# Altium schematic sheet PWR.SchDoc
size A3; SheetNumber: 5; SheetTotal: 8
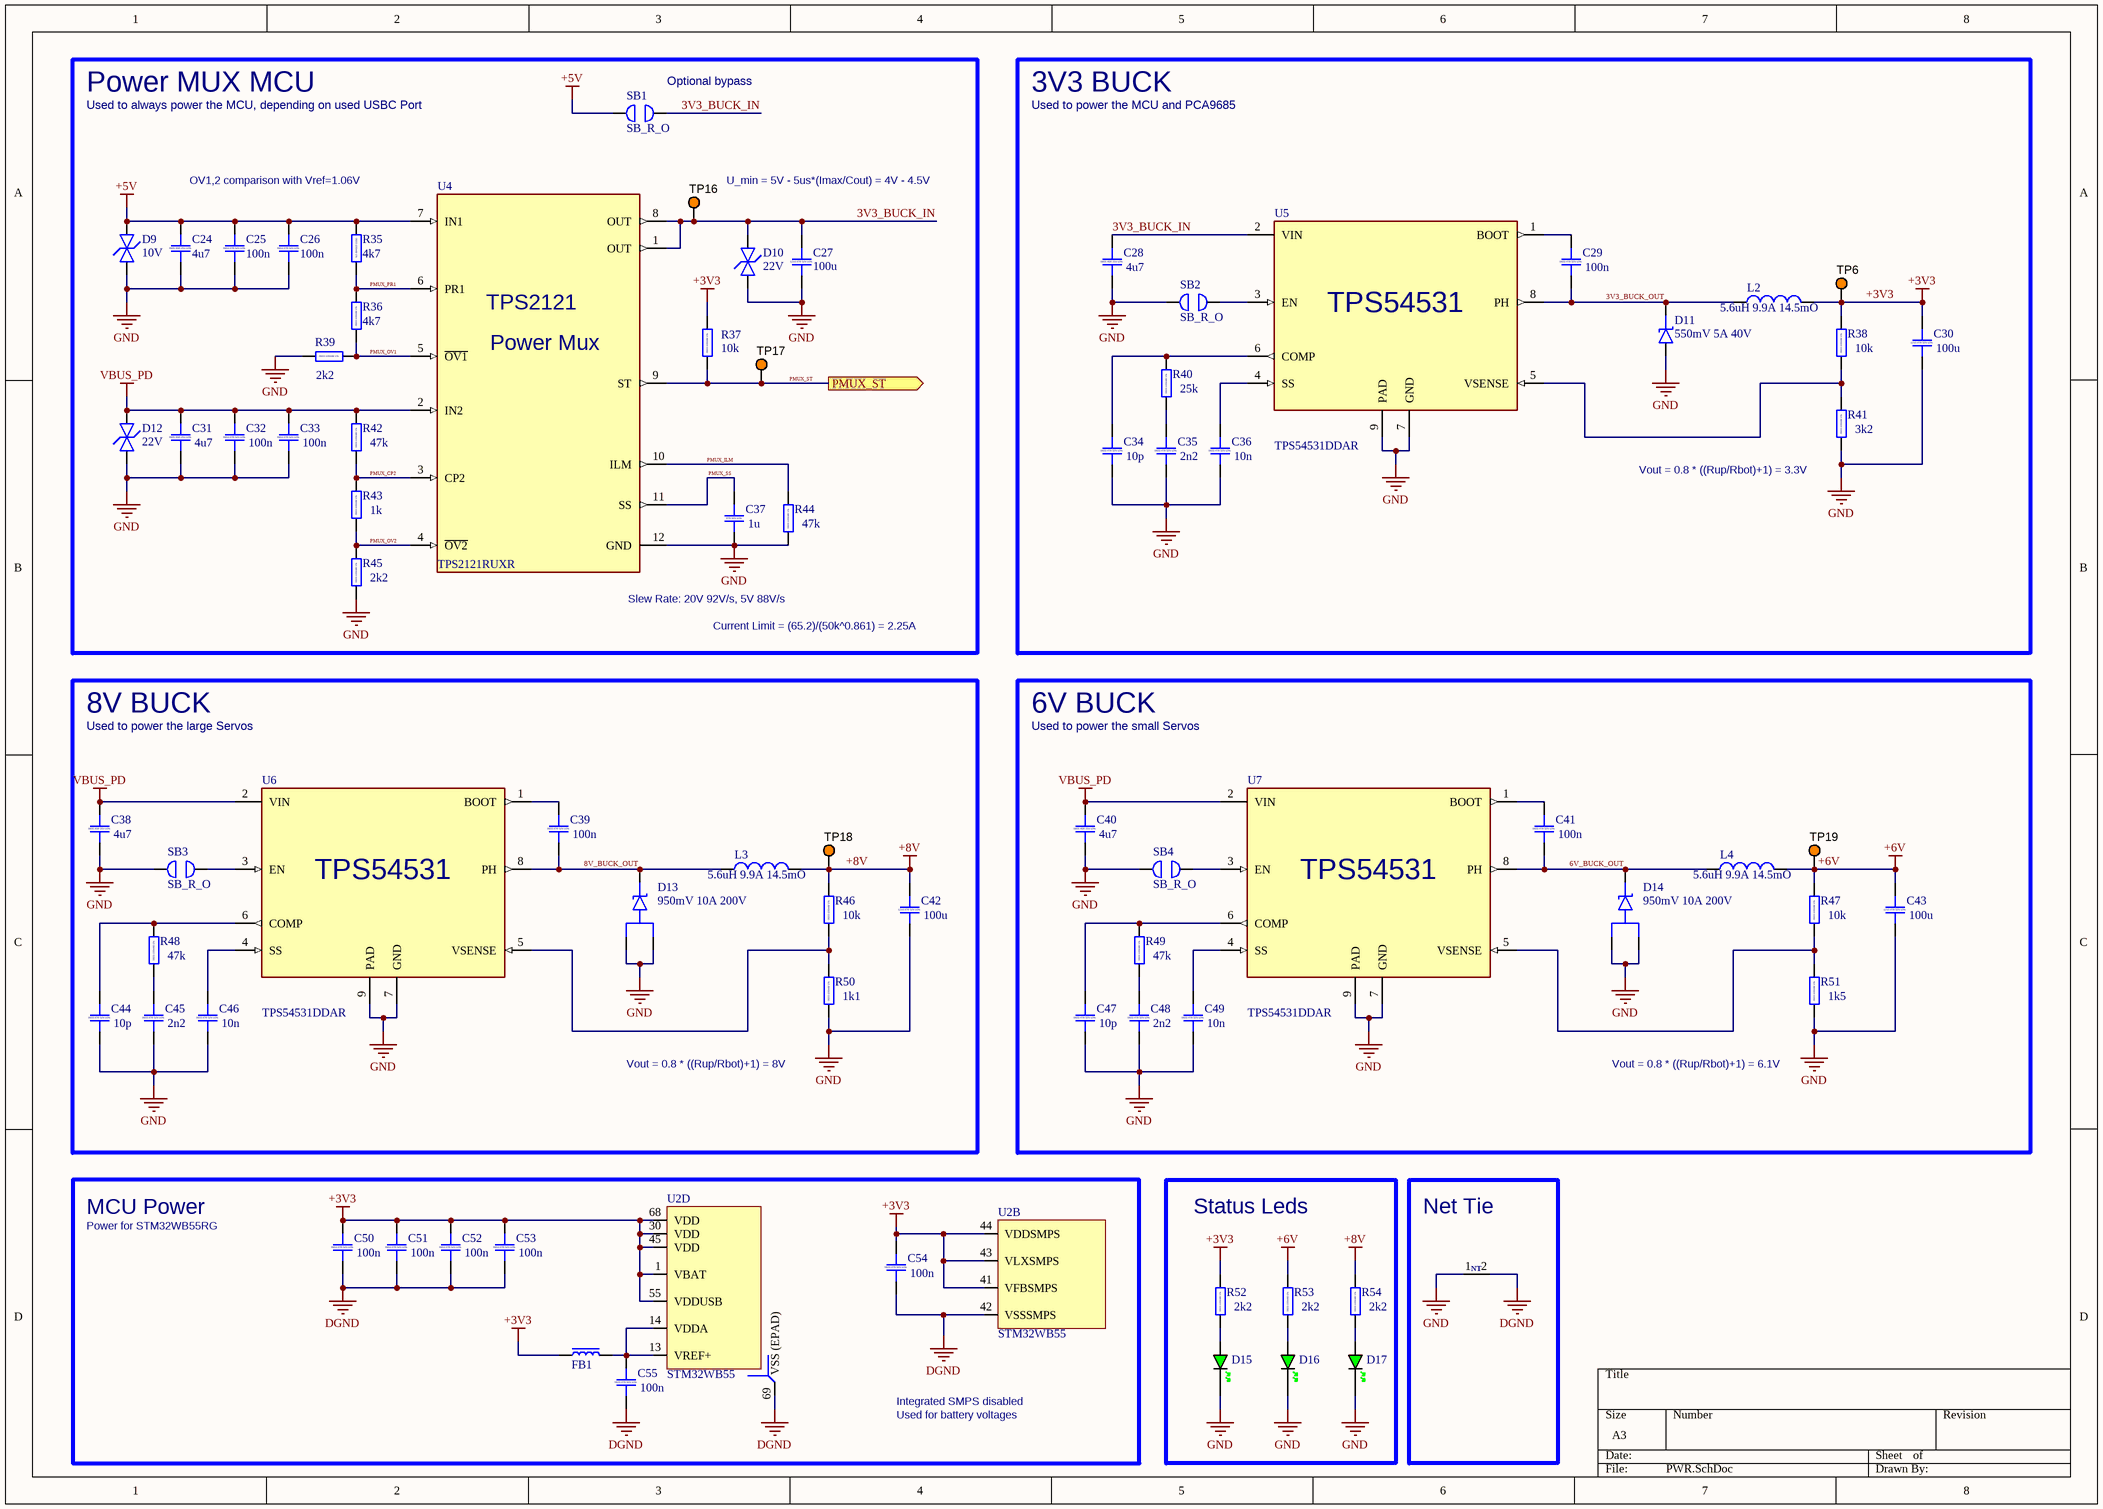
[diagram p0: PWR.SchDoc]

## Parts
C24  4u7  [CAP_0805]
C25  100n  [CAP_0603]
C26  100n  [CAP_0603]
C27  100u  [CAP_1210]
C28  4u7  [CAP_0805]
C29  100n  [CAP_0603]
C30  100u  [CAP_1210]
C31  4u7  [CAP_0805]
C32  100n  [CAP_0603]
C33  100n  [CAP_0603]
C34  10p  [CAP_0603]
C35  2n2  [CAP_0603]
C36  10n  [CAP_0603]
C37  1u  [CAP_0603]
C38  4u7  [CAP_0805]
C39  100n  [CAP_0603]
C40  4u7  [CAP_0805]
C41  100n  [CAP_0603]
C42  100u  [CAP_1210]
C43  100u  [CAP_1210]
C44  10p  [CAP_0603]
C45  2n2  [CAP_0603]
C46  10n  [CAP_0603]
C47  10p  [CAP_0603]
C48  2n2  [CAP_0603]
C49  10n  [CAP_0603]
C50  100n  [CAP_0603]
C51  100n  [CAP_0603]
C52  100n  [CAP_0603]
C53  100n  [CAP_0603]
C54  100n  [CAP_0603]
C55  100n  [CAP_0603]
D9  10V  [D_0603]
D10  22V  [D_0603]
D11  550mV 5A 40V  [SMC-DO-214AB]
D12  22V  [D_0603]
D13  950mV 10A 200V  [DPAK230P970X240-3N]
D14  950mV 10A 200V  [DPAK230P970X240-3N]
D15  LED_0603_GREEN  [LED_0603_GREEN]  (value not drawn)
D16  LED_0603_GREEN  [LED_0603_GREEN]  (value not drawn)
D17  LED_0603_GREEN  [LED_0603_GREEN]  (value not drawn)
FB1  FB_0603  [FB_0603]  (value not drawn)
L2  5.6uH 9.9A 14.5mO  [INDP6466X61N]
L3  5.6uH 9.9A 14.5mO  [INDP6466X61N]
L4  5.6uH 9.9A 14.5mO  [INDP6466X61N]
NT1  NetTie_1mm  [NETTIE]  (value not drawn)  (net tie, no BOM)
R35  4k7  [RES_0603]
R36  4k7  [RES_0603]
R37  10k  [RES_0603]
R38  10k  [RES_0603]
R39  2k2  [RES_0603]
R40  25k  [RES_0603]
R41  3k2  [RES_0603]
R42  47k  [RES_0603]
R43  1k  [RES_0603]
R44  47k  [RES_0603]
R45  2k2  [RES_0603]
R46  10k  [RES_0603]
R47  10k  [RES_0603]
R48  47k  [RES_0603]
R49  47k  [RES_0603]
R50  1k1  [RES_0603]
R51  1k5  [RES_0603]
R52  2k2  [RES_0603]
R53  2k2  [RES_0603]
R54  2k2  [RES_0603]
SB1  SB_R_O  [New footprint 1]
SB2  SB_R_O  [New footprint 1]
SB3  SB_R_O  [New footprint 1]
SB4  SB_R_O  [New footprint 1]
TP6  5003  [KSTN-5003]  (value not drawn)
TP16  5003  [KSTN-5003]  (value not drawn)
TP17  5003  [KSTN-5003]  (value not drawn)
TP18  5003  [KSTN-5003]  (value not drawn)
TP19  5003  [KSTN-5003]  (value not drawn)
U2  STM32WB55  [QFN40P800X800X100_HS-69N]  (parts B,D of 5)
U4  TPS2121RUXR  [FP-RUX0012A-MFG]
U5  TPS54531DDAR  [FP-DDA0008E-IPC_A]
U6  TPS54531DDAR  [FP-DDA0008E-IPC_A]
U7  TPS54531DDAR  [FP-DDA0008E-IPC_A]

## Blocks framed on the sheet
Power MUX MCU: C24-C27 C31-C33 C37 D9 D10 D12 R35-R37 R39 R42-R45 SB1 TP16 TP17 U4
3V3 BUCK: C28-C30 C34-C36 D11 L2 R38 R40 R41 SB2 TP6 U5
8V BUCK: C38 C39 C42 C44-C46 D13 L3 R46 R48 R50 SB3 TP18 U6
6V BUCK: C40 C41 C43 C47-C49 D14 L4 R47 R49 R51 SB4 TP19 U7
MCU Power: C50-C55 FB1 U2
Status Leds: D15-D17 R52-R54
Net Tie: NT1

## Ports
PMUX_ST (out)

## Nets
+3V3: C30.2 C50.1 C51.1 C52.1 C53.1 C54.1 FB1.1 L2.2 R37.2 R38.2 R52.2 TP6.1 U2.1(VBAT) U2.30(VDD) U2.41(VFBSMPS) U2.43(VLXSMPS) U2.44(VDDSMPS) U2.45(VDD) U2.55(VDDUSB) U2.68(VDD)
+5V: C24.2 C25.1 C26.1 D9.K R35.1 SB1.1 U4.7(IN1)
+6V: C43.2 L4.2 R47.2 R53.2 TP19.1
+8V: C42.2 L3.2 R46.2 R54.2 TP18.1
DGND: C50.2 C51.2 C52.2 C53.2 C54.2 C55.2 NT1.2 U2.42(VSSSMPS) U2.69(VSS_(EPAD))
GND: C24.1 C25.2 C26.2 C27.1 C28.1 C30.1 C31.1 C32.2 C33.2 C34.2 C35.2 C36.2 C37.2 C38.1 C40.1 C42.1 C43.1 C44.2 C45.2 C46.2 C47.2 C48.2 C49.2 D9.A D10.A D11.A D12.A D13.1(A) D13.2(A1) D14.1(A) D14.2(A1) D15.K D16.K D17.K NT1.1 R39.1 R41.1 R44.1 R45.1 R50.1 R51.1 SB2.1 SB3.1 SB4.1 U4.12(GND) U5.7(GND) U5.9(PAD) U6.7(GND) U6.9(PAD) U7.7(GND) U7.9(PAD)
VBUS_PD: C31.2 C32.1 C33.1 C38.2 C40.2 D12.K R42.2 U4.2(IN2) U6.2(VIN) U7.2(VIN)
3V3_BUCK_IN: C27.2 C28.2 D10.K SB1.2 TP16.1 U4.1(OUT) U4.8(OUT) U5.2(VIN)
3V3_BUCK_OUT: C29.2 D11.K L2.1 U5.8(PH)
6V_BUCK_OUT: C41.2 D14.3(K) L4.1 U7.8(PH)
8V_BUCK_OUT: C39.2 D13.3(K) L3.1 U6.8(PH)
PMUX_CP2: R42.1 R43.2 U4.3(CP2)
PMUX_ILM: R44.2 U4.10(ILM)
PMUX_OV1: R36.1 R39.2 U4.5(~{OV1})
PMUX_OV2: R43.1 R45.2 U4.4(~{OV2})
PMUX_PR1: R35.2 R36.2 U4.6(PR1)
PMUX_SS: C37.1 U4.11(SS)
PMUX_ST: R37.1 TP17.1 U4.9(ST) ; port PMUX_ST
NetC29_1: C29.1 U5.1(BOOT)
NetC34_1: C34.1 R40.2 U5.6(COMP)
NetC35_1: C35.1 R40.1
NetC36_1: C36.1 U5.4(SS)
NetC39_1: C39.1 U6.1(BOOT)
NetC41_1: C41.1 U7.1(BOOT)
NetC44_1: C44.1 R48.2 U6.6(COMP)
NetC45_1: C45.1 R48.1
NetC46_1: C46.1 U6.4(SS)
NetC47_1: C47.1 R49.2 U7.6(COMP)
NetC48_1: C48.1 R49.1
NetC49_1: C49.1 U7.4(SS)
NetC55_1: C55.1 FB1.2 U2.13(VREF+) U2.14(VDDA)
NetD15_A: D15.A R52.1
NetD16_A: D16.A R53.1
NetD17_A: D17.A R54.1
NetR38_1: R38.1 R41.2 U5.5(VSENSE)
NetR46_1: R46.1 R50.2 U6.5(VSENSE)
NetR47_1: R47.1 R51.2 U7.5(VSENSE)
NetSB2_2: SB2.2 U5.3(EN)
NetSB3_2: SB3.2 U6.3(EN)
NetSB4_2: SB4.2 U7.3(EN)

## Notes on the sheet
- Used to always power the MCU, depending on used USBC Port
- (near SB1) Optional bypass
- Used to power the MCU and PCA9685
- OV1,2 comparison with Vref=1.06V
- (near TP16) U_min = 5V - 5us*(Imax/Cout) = 4V - 4.5V
- (near R41) Vout = 0.8 * ((Rup/Rbot)+1) = 3.3V
- Slew Rate: 20V 92V/s, 5V 88V/s
- Current Limit = (65.2)/(50k^0.861) = 2.25A
- Used to power the large Servos
- Used to power the small Servos
- Vout = 0.8 * ((Rup/Rbot)+1) = 8V
- Vout = 0.8 * ((Rup/Rbot)+1) = 6.1V
- Power for STM32WB55RG
- Integrated SMPS disabled
- Used for battery voltages
- (in symbol CMP-001-00113-2) X7R 50V 10%
- (in symbol CMP-001-00113-3) 0603 X7R 50V 10%
- (in symbol CMP-001-38826-1) 0805 X5R 25V 10%
- (in symbol CMP-001-38827-2) 1210 X7R 50V 10%
- (in symbol CMP-009-00179-5) 0603 100mW 1%
- (in symbol CMP-019-00049-4) TPS2121; Power Mux
- (in symbol CMP-024-000416-1) NT
- (in symbol CMP-031-00231-2) TPS54531

## Library data of the parts
C24 C28 C31 C38 C40 = CMP-001-38826-1: Capacitor SMD 0805; Manufacturer Part Number: *; Rating: *; Dielectric: *; Design Item ID: CAP_0805; Manufacturer: *; Distributor Link: *; LCSC: *; Source: Schematic-Lib-PhilsLab.SchLib
  C24: Value: 4u7
C25 C26 C29 C32-C36 C39 C41 C44-C55 = CMP-001-00113-3: Capacitor SMD 0603; Manufacturer: *; Rating: *; Distributor Link: *; Source: Schematic-Lib-PhilsLab.SchLib; Manufacturer Part Number: *; Dielectric: *; LCSC: *; Design Item ID: CAP_0603
  C25 C26: Value: 100n
C27 C30 C42 C43 = CMP-001-38827-2: Capacitor SMD 1210; Design Item ID: CAP_1210; Manufacturer: *; Source: Schematic-Lib-PhilsLab.SchLib; Manufacturer Part Number: *; Distributor Link: *; Rating: *; Dielectric: *; LCSC: *
C37 = CMP-001-00113-2: Capacitor SMD 0603; LCSC: *; Rating: *; Dielectric: *; Design Item ID: CAP_0603; Distributor Link: *; Manufacturer: *; Source: Schematic-Lib-PhilsLab.SchLib; Manufacturer Part Number: *
D9 D10 D12 = CMP-004-00043-1: Diode TVS / ESD Bidirectional 0603; Source: Schematic-Lib-PhilsLab.SchLib; Manufacturer: *; Design Item ID: D_TVS_BI_0603; Manufacturer Part Number: *
D11 = CMP-004-00048-1: Diode Schottky SMD SMC (DO-214AB); Distributor Link: *; Design Item ID: D_SCHOTTKY_SMC; Source: Schematic-Lib-PhilsLab.SchLib
D13 D14 = CMP-004-00137-2: Diode Schottky DPAK; Design Item ID: D_SCHOTTKY_SMA; Source: Schematic-Lib-PhilsLab.SchLib
D15-D17 = CMP-004-00051-1: LED 0603 GREEN SMD; Source: Schematic-Lib-PhilsLab.SchLib; Design Item ID: LED_0603_GREEN
FB1 = CMP-006-00022-1: Ferrite Bead SMD 0603; Manufacturer Part Number: *; LCSC: *; Manufacturer: *; Distributor Link: *; Source: Schematic-Lib-PhilsLab.SchLib; Design Item ID: FB_0603
L2-L4 = CMP-006-00096-1: Max Current Rating: 10A; Self Resonant Frequency: 20MHz; Tolerance: 20%; RoHS Compliant: Yes; Max Operating Temperature: 165°C; Min Operating Temperature: -40°C; Pins: 2
NT1 = CMP-024-000416-1: Net Tie; Design Item ID: NetTie; Source: Schematic-Lib-PhilsLab.SchLib
R35-R54 = CMP-009-00179-5: Resistor 0603 100mW 1%; LCSC: *; Distributor Link: *; Manufacturer Part Number: *; Design Item ID: RES_0603; Manufacturer: *; Source: Schematic-Lib-PhilsLab.SchLib
  R35 R36: Value: 4k7
  R39: Value: 2k2
SB1-SB4 = CMP-00000-3: Solderbridge Round and Open
TP6 TP16-TP19 = CMP-002-00037-2: Test Point, Orange, Height 4.6 mm, Tail Length 3 mm, 1-Pin THD, RoHS; Manufacturer: Keystone; Colour: Orange; Packaging: Bulk; Package Description: 1-Pin Through Hole Device, Dia 2.54 mm; Pins: 1; Package Reference: 5003; Datasheet Version: Jun-15; Case/Package: 5003; Mounting Technology: TH; Connector Type: TestPoint; Diameter: 2.54mm; Contact Material: Bronze; Datasheet URL: http://keyelco.com/userAssets/file/M65p56.pdf; Manufacturer URL: http://www.keyelco.com/; Package Quantity: 10; Contact Plating: Tin; RoHS Compliant: True
U2 = CMP-031-00230-3: Multiprotocol wireless 32-bit MCU Arm®-based Cortex®-M4
U4 = CMP-019-00049-4: Power Supply Support Circuit, Adjustable, 1 Channel, PQCC12; RoHS Compliant: Yes
U5-U7 = CMP-031-00231-2: Switching Regulator, Current-mode, 5A, 570kHz Switching Freq-Max, PDSO8; Max Supply Voltage: 28V; Pins: 8; RoHS Compliant: Yes; Min Operating Temperature: -40°C; Max Operating Temperature: 85°C; Case/Package: HLSOP